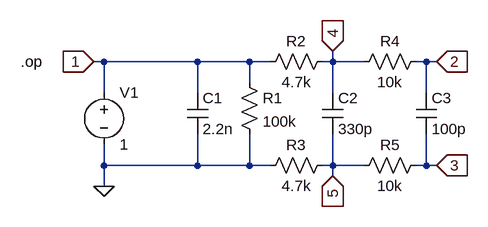
[diagram p0: schematic SIDO-low-pass-filter.asc]
SIDO-low-pass-filter.asc, the LTspice schematic file:
Version 4
SHEET 1 880 680
WIRE 80 128 64 128
WIRE 224 128 80 128
WIRE 304 128 224 128
WIRE 336 128 304 128
WIRE 432 128 432 112
WIRE 432 128 416 128
WIRE 480 128 432 128
WIRE 576 128 560 128
WIRE 592 128 576 128
WIRE 304 160 304 128
WIRE 80 176 80 128
WIRE 224 176 224 128
WIRE 432 176 432 128
WIRE 576 176 576 128
WIRE 80 288 80 256
WIRE 224 288 224 240
WIRE 224 288 80 288
WIRE 304 288 304 240
WIRE 304 288 224 288
WIRE 336 288 304 288
WIRE 432 288 432 240
WIRE 432 288 416 288
WIRE 480 288 432 288
WIRE 576 288 576 240
WIRE 576 288 560 288
WIRE 592 288 576 288
WIRE 432 304 432 288
WIRE 80 320 80 288
FLAG 80 320 0
FLAG 64 128 1
IOPIN 64 128 In
FLAG 432 112 4
IOPIN 432 112 In
FLAG 592 128 2
IOPIN 592 128 In
FLAG 592 288 3
IOPIN 592 288 In
FLAG 432 304 5
IOPIN 432 304 In
SYMBOL voltage 80 160 R0
SYMATTR InstName V1
SYMATTR Value 1
SYMBOL cap 208 176 R0
SYMATTR InstName C1
SYMATTR Value 2.2n
SYMBOL cap 416 176 R0
SYMATTR InstName C2
SYMATTR Value 330p
SYMBOL cap 560 176 R0
SYMATTR InstName C3
SYMATTR Value 100p
SYMBOL res 288 144 R0
SYMATTR InstName R1
SYMATTR Value 100k
SYMBOL res 432 112 R90
WINDOW 0 0 56 VBottom 2
WINDOW 3 32 56 VTop 2
SYMATTR InstName R2
SYMATTR Value 4.7k
SYMBOL res 432 272 R90
WINDOW 0 0 56 VBottom 2
WINDOW 3 32 56 VTop 2
SYMATTR InstName R3
SYMATTR Value 4.7k
SYMBOL res 576 112 R90
WINDOW 0 0 56 VBottom 2
WINDOW 3 32 56 VTop 2
SYMATTR InstName R4
SYMATTR Value 10k
SYMBOL res 576 272 R90
WINDOW 0 0 56 VBottom 2
WINDOW 3 32 56 VTop 2
SYMATTR InstName R5
SYMATTR Value 10k
TEXT -48 128 Left 2 !.op

The netlist it stands for:
* SIDO-low-pass-filter.asc
V1 1 0 1
C1 1 0 2.2n
C2 4 5 330p
C3 2 3 100p
R1 1 0 100k
R2 4 1 4.7k
R3 5 0 4.7k
R4 2 4 10k
R5 3 5 10k
.op
.backanno
.end